# Altium schematic sheet DXP格式 单片机八路抢答器.SchDoc
size A4
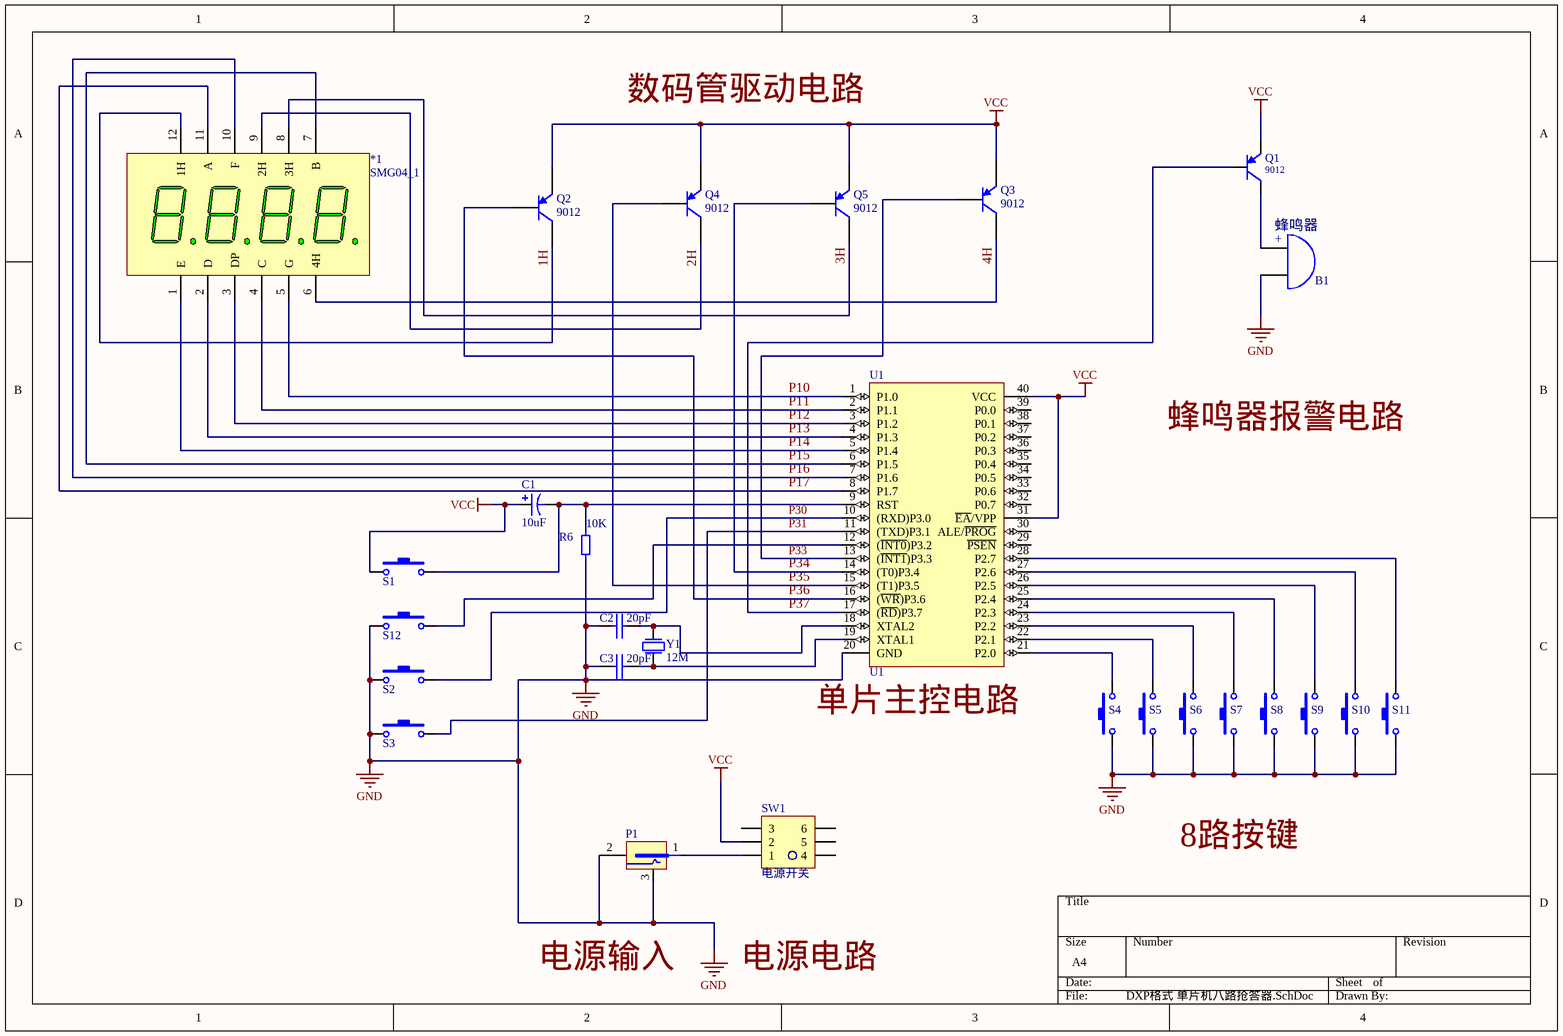
[diagram p0: DXP格式 单片机八路抢答器.SchDoc]

## Parts
*1  SMG04_1  [SMG04]
B1  蜂鸣器  [Bett]
C1  10uF  [C_10]
C2  20pF  [CAP5]
C3  20pF  [CAP5]
P1  电源输入  [DC2.1]  (value not drawn)
Q1  9012  [s三极管直插]
Q2  9012  [s三极管直插]
Q3  9012  [s三极管直插]
Q4  9012  [s三极管直插]
Q5  9012  [s三极管直插]
R6  10K  [AXIAL0.3]
S1  SW-PB  [key]  (value not drawn)
S2  SW-PB  [key]  (value not drawn)
S3  SW-PB  [key]  (value not drawn)
S4  SW-PB  [key]  (value not drawn)
S5  SW-PB  [key]  (value not drawn)
S6  SW-PB  [key]  (value not drawn)
S7  SW-PB  [key]  (value not drawn)
S8  SW-PB  [key]  (value not drawn)
S9  SW-PB  [key]  (value not drawn)
S10  SW-PB  [key]  (value not drawn)
S11  SW-PB  [key]  (value not drawn)
S12  SW-PB  [key]  (value not drawn)
SW1  电源开关  [sw_自锁 1]
U1  U1  [DIP40 - 做板]
Y1  12M  [XTAL]

## Nets
GND: B1.2(B) C2.1 C3.1 P1.2 P1.3 R6.1 S2.1 S3.1 S4.1 S5.1 S6.1 S7.1 S8.1 S9.1 S10.1 S11.1 S12.1 U1.20(GND)
VCC: C1.1 Q1.1(E) Q2.1(E) Q3.1(E) Q4.1(E) Q5.1(E) S1.1 SW1.2 U1.31(~{EA}/VPP) U1.40(VCC)
1H: *1.12(1H) Q2.3(C)
2H: *1.9(2H) Q4.3(C)
3H: *1.8(3H) Q5.3(C)
4H: *1.6(4H) Q3.3(C)
P10: *1.5(G) U1.1(P1.0)
P11: *1.4(C) U1.2(P1.1)
P12: *1.3(DP) U1.3(P1.2)
P13: *1.2(D) U1.4(P1.3)
P14: *1.1(E) U1.5(P1.4)
P15: *1.7(B) U1.6(P1.5)
P16: *1.10(F) U1.7(P1.6)
P17: *1.11(A) U1.8(P1.7)
P30: S2.2 U1.10((RXD)P3.0)
P31: S3.2 U1.11((TXD)P3.1)
P33: Q3.2(B) U1.13((~{INT1})P3.3)
P34: Q5.2(B) U1.14((T0)P3.4)
P35: Q4.2(B) U1.15((T1)P3.5)
P36: Q2.2(B) U1.16((~{WR})P3.6)
P37: Q1.2(B) U1.17((~{RD})P3.7)
NetB1_1: B1.1(A) Q1.3(C)
NetC1_2: C1.2 R6.2 S1.2 U1.9(RST)
NetC2_2: C2.2 U1.18(XTAL2) Y1.1(P1)
NetC3_2: C3.2 U1.19(XTAL1) Y1.2(P2)
NetP1_1: P1.1 SW1.1
NetS4_2: S4.2 U1.21(P2.0)
NetS5_2: S5.2 U1.22(P2.1)
NetS6_2: S6.2 U1.23(P2.2)
NetS7_2: S7.2 U1.24(P2.3)
NetS8_2: S8.2 U1.25(P2.4)
NetS9_2: S9.2 U1.26(P2.5)
NetS10_2: S10.2 U1.27(P2.6)
NetS11_2: S11.2 U1.28(P2.7)
NetS12_2: S12.2 U1.12((~{INT0})P3.2)

Not connected (* = marked no-connect by the designer): SW1 3 4 5 6; U1 29(~{PSEN}) 30(ALE/~{PROG}) 32(P0.7) 33(P0.6) 34(P0.5) 35(P0.4) 36(P0.3) 37(P0.2) 38(P0.1) 39(P0.0)

## Notes on the sheet
- (near B1) +
- Labels drawn without touching a wire or pin: 8路按键, 单片主控电路, 数码管驱动电路, 电源电路, 电源输入, 蜂鸣器报警电路

## Library data of the parts
B1 = BELL
C1 = Cap Pol1: Polarized Capacitor (Radial); Published: 8-Jun-2000; LatestRevisionDate: 17-Jul-2002; LatestRevisionNote: Re-released for DXP Platform.; PackageReference: RB7.6-15; Publisher: Altium Limited
C2 C3 = CAP: 电容
P1 = POWER
Q1-Q5 = 2N3906: PNP General Purpose Amplifier; Published: 8-Jun-2000; LatestRevisionDate: 15-Jan-2003; LatestRevisionNote: PCB Footprint 'BCY-W3/D4.7' replaced; PackageReference: TO-92A; Publisher: Altium Limited; Code_JEDEC: TO-92A; ComponentLink1Description: Manufacturer Link; ComponentLink1URL: http://www.fairchildsemi.com/; ComponentLink2Description: Datasheet; ComponentLink2URL: http://www.fairchildsemi.com/ds/2N%2F2N3906.pdf
  Q1: DatasheetDocument: 1997; PackageDocument: Sep-1998
  Q2-Q5: DatasheetVersion: 1997; PackageVersion: Sep-1998
R6 = RES2
S1-S12 = SW-PB: Switch; Published: 24-Mar-1999; LatestRevisionDate: 17-Jul-2002; LatestRevisionNote: Re-released for DXP Platform.; PackageReference: SPST-2; Publisher: Altium Limited
SW1 = SW1
Y1 = 16M: Crystal Oscillator